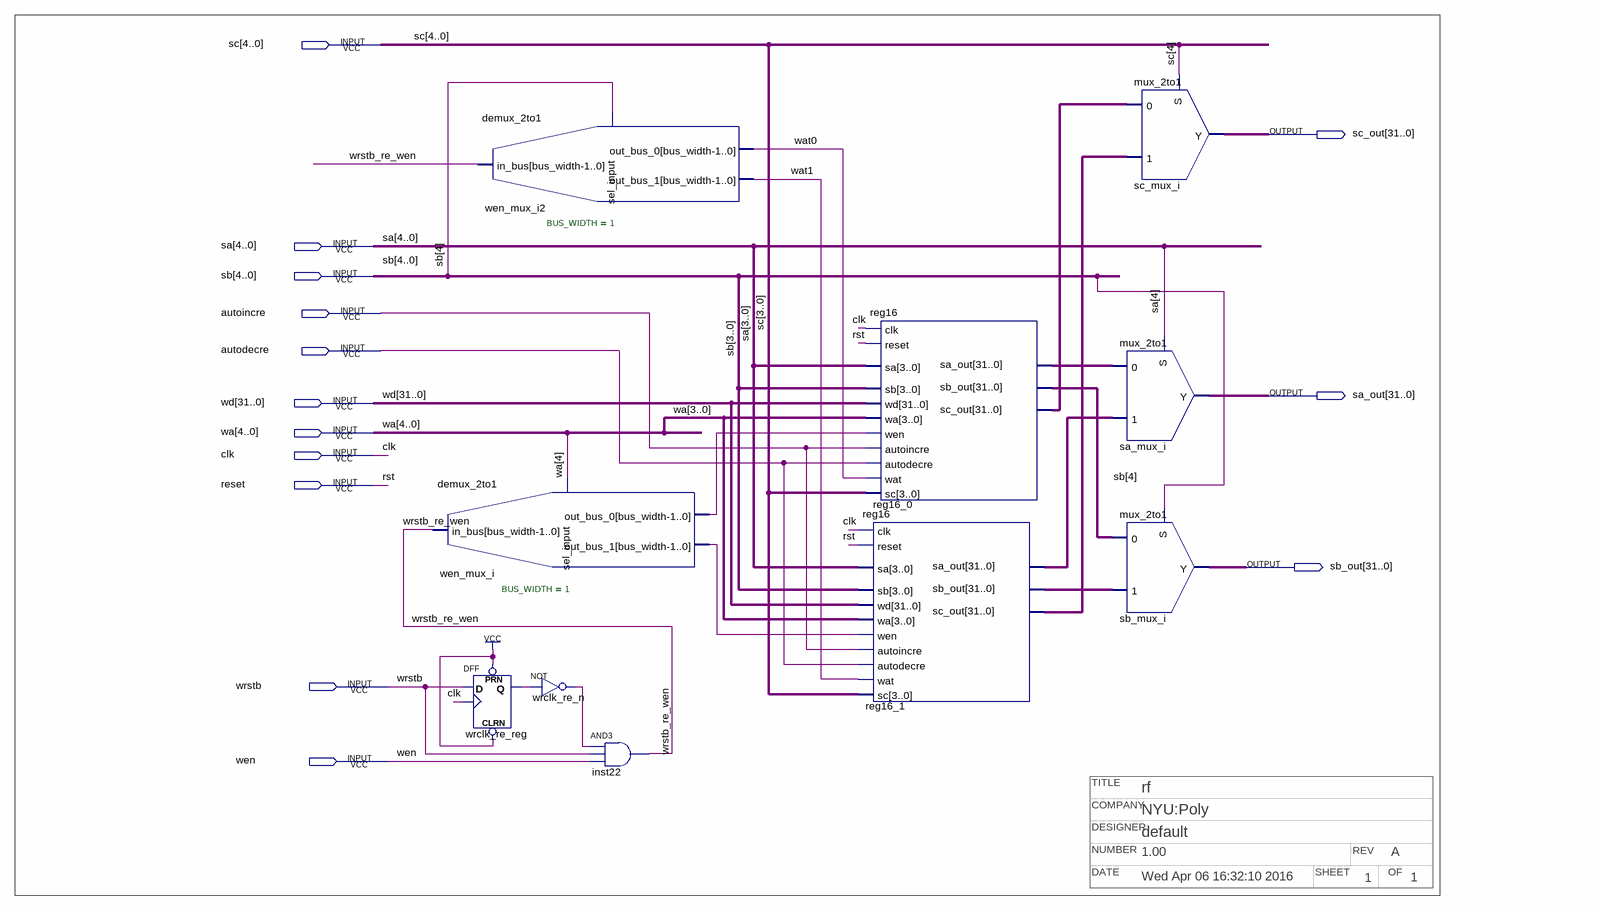
[diagram p0: schematic sheet]
// Quartus schematic rf.bdf as structural Verilog: 10 symbols, 14 pins
// Title block: COMPANY: NYU:Poly; DATE: Wed Apr 06 16:32:10 2016; DESIGNER: default; NUMBER: 1.00; OF: 1; REV: A; SHEET: 1; TITLE: rf
module rf (
  input  [4:0] sc,
  input  [4:0] sa,
  input  [4:0] sb,
  input  autoincre,
  input  autodecre,
  input  [31:0] wd,
  input  [4:0] wa,
  input  clk,
  input  reset,
  input  wrstb,
  input  wen,
  output [31:0] sc_out,
  output [31:0] sa_out,
  output [31:0] sb_out
);

  wire wat0, wat1, wen_mux_i_out_bus_0, wen_mux_i_out_bus_1, wrclk_1_not, wrstb_1, wrstb_re_wen;
  wire [31:0] reg16_0_sc_out, reg16_1_sc_out, sa_out0, sa_out_b, sb_out0, sb_out_b;

  demux_2to1 #(.BUS_WIDTH(1)) wen_mux_i (
    .sel_input(wa[4]), .in_bus(wrstb_re_wen), .out_bus_0(wen_mux_i_out_bus_0), .out_bus_1(wen_mux_i_out_bus_1));
  demux_2to1 #(.BUS_WIDTH(1)) wen_mux_i2 (.sel_input(sb[4]), .in_bus(wrstb_re_wen), .out_bus_0(wat0), .out_bus_1(wat1));
  DFF wrclk_re_reg (.CLRN(1'b1), .CLK(clk), .D(wrstb), .PRN(1'b1), .Q(wrstb_1));
  not wrclk_re_n (wrclk_1_not, wrstb_1);
  and inst22 (wrstb_re_wen, wrclk_1_not, wrstb, wen);
  reg16 reg16_0 (
    .sc(sc[3:0]), .sa(sa[3:0]), .sb(sb[3:0]), .autoincre(autoincre), .autodecre(autodecre), .clk(clk),
    .reset(reset), .wat(wat0), .wd(wd), .wa(wa[3:0]), .wen(wen_mux_i_out_bus_0), .sc_out(reg16_0_sc_out),
    .sa_out(sa_out0), .sb_out(sb_out0));
  reg16 reg16_1 (
    .sc(sc[3:0]), .sa(sa[3:0]), .sb(sb[3:0]), .autoincre(autoincre), .autodecre(autodecre), .clk(clk),
    .reset(reset), .wat(wat1), .wd(wd), .wa(wa[3:0]), .wen(wen_mux_i_out_bus_1), .sc_out(reg16_1_sc_out),
    .sa_out(sa_out_b), .sb_out(sb_out_b));
  mux_2to1 sc_mux_i (.in_bus_1(reg16_1_sc_out), .in_bus_0(reg16_0_sc_out), .sel_input(sc[4]), .out_bus(sc_out));
  mux_2to1 sa_mux_i (.in_bus_1(sa_out_b), .in_bus_0(sa_out0), .sel_input(sa[4]), .out_bus(sa_out));
  mux_2to1 sb_mux_i (.in_bus_1(sb_out_b), .in_bus_0(sb_out0), .sel_input(sb[4]), .out_bus(sb_out));

  // Other names for the same wires on the sheet: rst = reset; sb_mux[31:0] = sb_out
endmodule
